# Altium schematic sheet Estacion_Meteorologica_Feather _M0.SchDoc
size A4; SheetNumber: 1; SheetTotal: 4; SPICEModelCacheEYFLLTXP: <root> / <DocumentId>EYFLLTXP</DocumentId> / </root>
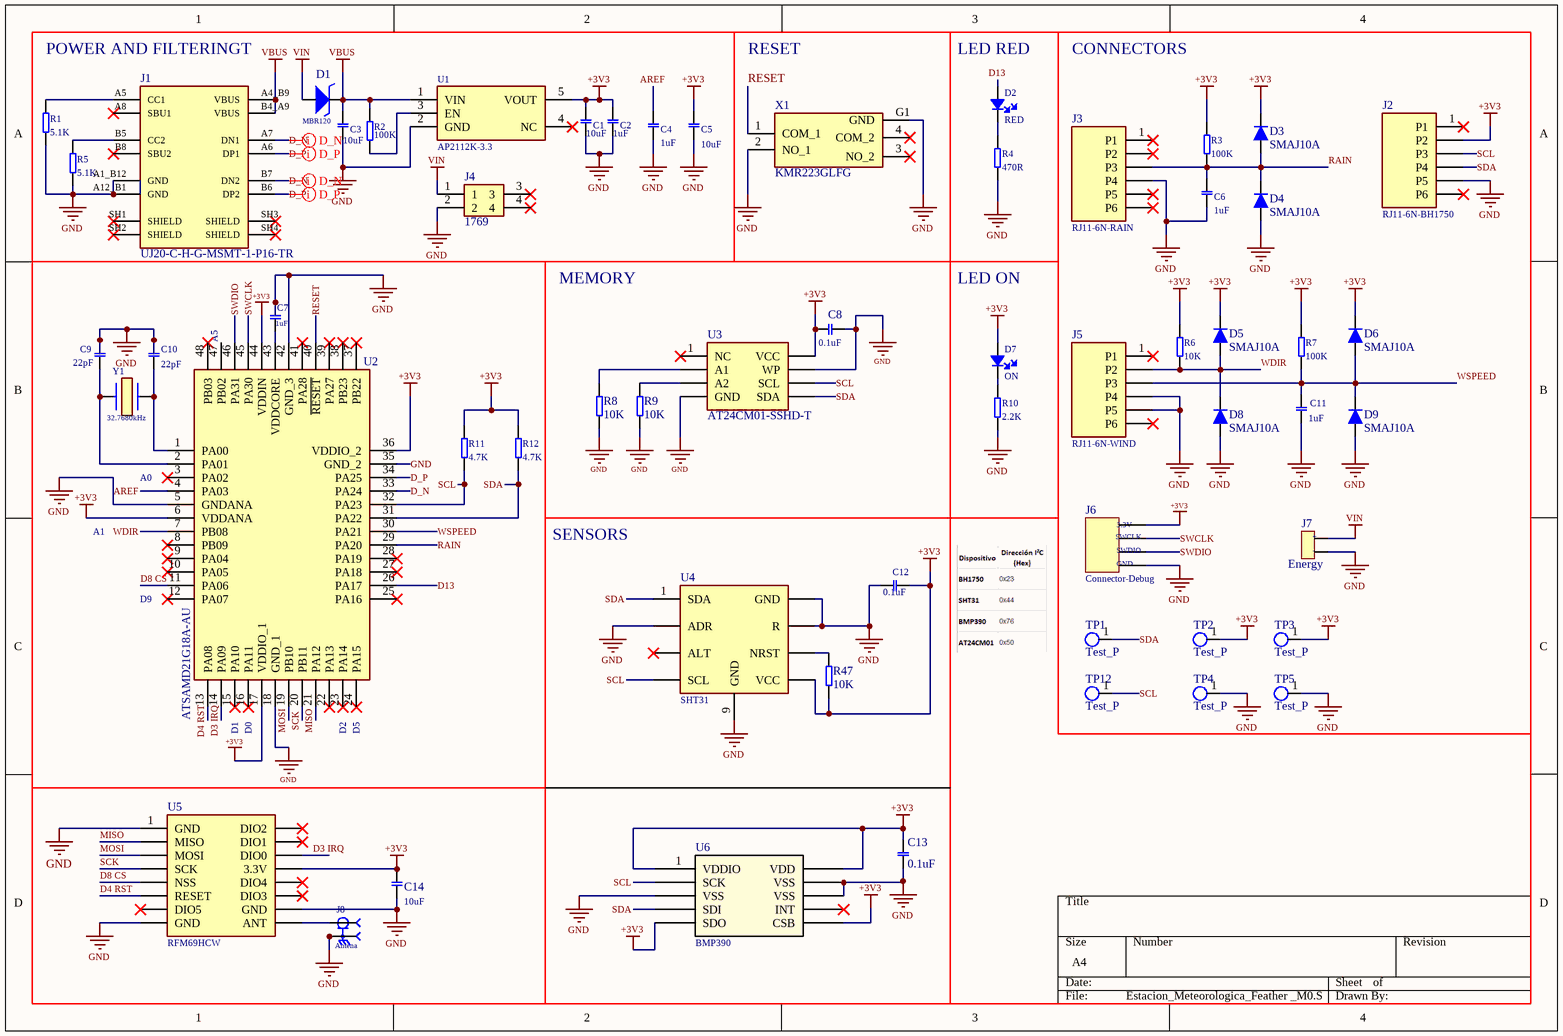
[diagram p0: Estacion_Meteorologica_Feather _M0.SchDoc]

## Parts
C1  10uF  [CAPCP1608_0603]
C2  1uF  [CAPCP1608_0603]
C3  10uF  [CAPCP1608_0603]
C4  1uF  [CAPCP1608_0603]
C5  10uF  [CAPCP1608_0603]
C6  1uF  [CAPCP1608_0603]
C7  1uF  [CAPCP1608_0603]
C8  0.1uF  [CAPCP1608_0603]
C9  22pF  [CAPCP1608_0603]
C10  22pF  [CAPCP1608_0603]
C11  1uF  [CAPCP1608_0603]
C12  0.1uF  [CAPCP1608_0603]
C13  0.1uF  [CAPCP1608_0603]
C14  10uF  [CAPCP1608_0603]
D1  MBR120  [SODFL3616X98N]
D2  RED  [DIODO_0603]
D3  SMAJ10A  [DIOM4325X250N]
D4  SMAJ10A  [DIOM4325X250N]
D5  SMAJ10A  [DIOM4325X250N]
D6  SMAJ10A  [DIOM4325X250N]
D7  ON  [DIODO_0603]
D8  SMAJ10A  [DIOM4325X250N]
D9  SMAJ10A  [DIOM4325X250N]
J1  UJ20-C-H-G-MSMT-1-P16-TR  [uJ20-C-H-G-MSMT-1-P16-TR]
J2  RJ11-6N-BH1750  [TE_RJ11-6N-B]
J3  RJ11-6N-RAIN  [TE_RJ11-6N-B]
J4  1769  [1769_Conector_Bateria]
J5  RJ11-6N-WIND  [TE_RJ11-6N-B]
J6  Connector-Debug  [HDR1X4]
J7  Energy  [HDR1X2_2]
J8  Antena  [SAMTEC_RSP-122811-01]
R1  5.1K  [RESC1608_0603]
R2  100K  [RESC1608_0603]
R3  100K  [RESC1608_0603]
R4  470R  [RESC1608_0603]
R5  5.1K  [RESC1608_0603]
R6  10K  [RESC1608_0603]
R7  100K  [RESC1608_0603]
R8  10K  [RESC1608_0603]
R9  10K  [RESC1608_0603]
R10  2.2K  [RESC1608_0603]
R11  4.7K  [RESC1608_0603]
R12  4.7K  [RESC1608_0603]
R47  10K  [RESC1608_0603]
TP1  Test_P  [Test_point]
TP2  Test_P  [Test_point]
TP3  Test_P  [Test_point]
TP4  Test_P  [Test_point]
TP5  Test_P  [Test_point]
TP12  Test_P  [Test_point]
U1  AP2112K-3.3  [SOT-23-5]
U2  ATSAMD21G18A-AU  [QFP-48N]
U3  AT24CM01-SSHD-T  [SOIC-8N]
U4  SHT31  [SON50P250X250X90-9T110X180N]
U5  RFM69HCW  [COM-13909]
U6  BMP390  [10LGA_2X2X0p75_BOS-M]
X1  KMR223GLFG  [KMR223GLFG_Boton]
Y1  32.7680kHz  [XTAL 830050789]

## Nets
+3V3: C1.2 C2.2 C5.2 C8.1 C12.2 C13.2 C14.2 D3.2 D5.2 D6.2 D7.1 J2.2(P2) J6.1 R3.2 R6.2 R7.2 R11.2 R12.2 R47.1 TP2.1 TP3.1 U1.5(VOUT) U2.6(VDDANA) U2.17(VDDIO_1) U2.36(VDDIO_2) U2.44(VDDIN) U3.8(VCC) U4.5(VCC) U5.13(3.3V) U6.1(VDDIO) U6.5(SDO) U6.6(CSB) U6.10(VDD)
GND: C1.1 C2.1 C3.1 C4.1 C5.1 C6.1 C7.2 C8.2 C9.2 C10.2 C11.1 C12.1 C13.1 C14.1 D4.1 D8.1 D9.1 J1.A1_B12(GND) J1.A12_B1(GND) J2.5(P5) J3.4(P4) J4.2 J5.4(P4) J5.5(P5) J6.4 J7.2 J8.G1(GND) J8.G2(GND) R1.1 R4.1 R5.1 R8.1 R9.1 R10.2 TP4.1 TP5.1 U1.2(GND) U2.5(GNDANA) U2.18(GND_1) U2.35(GND_2) U2.42(GND_3) U3.4(GND) U3.7(WP) U4.2(ADR) U4.7(R) U4.8(GND) U4.9(GND) U5.1(GND) U5.8(GND) U5.10(GND) U6.3(VSS) U6.8(VSS) U6.9(VSS) X1.2(NO_1) X1.G1(GND)
VBUS: C3.2 D1.2 J1.A4_B9(VBUS) J1.B4_A9(VBUS) R2.2 U1.1(VIN)
VIN: D1.1 J4.1 J7.1
AREF: C4.2 U2.4(PA03)
D3 IRQ: U2.14(PA09) U5.14(DIO0)
D4 RST: U2.13(PA08) U5.6(RESET)
D8 CS: U2.11(PA06) U5.5(NSS)
D13: D2.1 U2.26(PA17)
D_N: J1.A7(DN1) J1.B7(DN2) U2.33(PA24)
D_P: J1.A6(DP1) J1.B6(DP2) U2.34(PA25)
MISO: U2.21(PA12) U5.2(MISO)
MOSI: U2.19(PB10) U5.3(MOSI)
RAIN: C6.2 D3.1 D4.2 J3.3(P3) R3.1 U2.29(PA20)
RESET: U2.40(~{RESET}) X1.1(COM_1)
SCK: U2.20(PB11) U5.4(SCK)
SCL: J2.3(P3) R11.1 TP12.1 U2.32(PA23) U3.6(SCL) U4.4(SCL) U6.2(SCK)
SDA: J2.4(P4) R12.1 TP1.1 U2.31(PA22) U3.5(SDA) U4.1(SDA) U6.4(SDI)
SWCLK: J6.2 U2.45(PA30)
SWDIO: J6.3 U2.46(PA31)
WDIR: D5.1 D8.2 J5.2(P2) R6.1 U2.7(PB08)
WSPEED: C11.2 D6.1 D9.2 J5.3(P3) R7.1 U2.30(PA21)
NetC7_1: C7.1 U2.43(VDDCORE)
NetC9_1: C9.1 U2.2(PA01) Y1.1
NetC10_1: C10.1 U2.1(PA00) Y1.2
NetD2_2: D2.2 R4.2
NetD7_2: D7.2 R10.1
NetJ1_A5: J1.A5(CC1) R1.2
NetJ1_B5: J1.B5(CC2) R5.2
NetJ8_1: J8.1 U5.9(ANT)
NetR2_1: R2.1 U1.3(EN)
NetR8_2: R8.2 U3.2(A1)
NetR9_2: R9.2 U3.3(A2)
NetR47_2: R47.2 U4.6(NRST)

Not connected (* = marked no-connect by the designer): J1 A8(SBU1)* B8(SBU2)* SH1(SHIELD)* SH2(SHIELD)* SH3(SHIELD)* SH4(SHIELD)*; J2 1(P1)* 6(P6)*; J3 1(P1)* 2(P2)* 5(P5)* 6(P6)*; J4 3* 4*; J5 1(P1)* 6(P6)*; U1 4(NC)*; U2 3(PA02)* 8(PB09)* 9(PA04)* 10(PA05)* 12(PA07)* 15(PA10)* 16(PA11)* 22(PA13)* 23(PA14)* 24(PA15)* 25(PA16)* 27(PA18)* 28(PA19)* 37(PB22)* 38(PB23)* 39(PA27)* 41(PA28)* 47(PB02) 48(PB03)*; U3 1(NC)*; U4 3(ALT)*; U5 7(DIO5)* 11(DIO3)* 12(DIO4)* 15(DIO1)* 16(DIO2)*; U6 7(INT)*; X1 3(NO_2)* 4(COM_2)*

## Layout directives
differential pair: D_N, D_P

## Notes on the sheet
- POWER AND FILTERINGT
- RESET
- (near D2) LED RED
- CONNECTORS
- MEMORY
- LED ON
- (near U2) A5
- (near U2) A0
- A1
- SENSORS
- (near U2) D9
- (near U2) D1
- (near U2) D0
- (near U2) D2
- (near U2) D5
- (in symbol Connector_04_debug) 3.3V; SWCLK; SWDIO; GND
- (in symbol Connector_energy) +; -

## Library data of the parts
C1 C3 C5 C14 = C0603X100J1GACAUTO: Capacitor_10uF_0603
C2 C4 C6 C7 C11 = C0603X105J4RACTU: Capacitor_1uF_0603
C8 C12 C13 = 06035C104K4T4A: Capacitor_0.1uF_0603
C9 C10 = C0603C220J1GAC: Capacitor_22pF_0603
D1 = MBR120ESFT3G: Diodo_Zenner_Sod-123FL-2
D2 D7 = SML-D12D1WT86: LED_NARANJA_0603
D3-D6 D8 D9 = SMAJ10A: TVS Diode 10V 400W Unidirectional SMAJ10A (DO-214AC)
J1 = UJ20-C-H-G-MSMT-1-P16-TR: Conector usb c; Package: None; Price: None; Value: *; MP: UJ20-C-H-G-MSMT-1-P16-TR; Availability: Unavailable
J2 J3 J5 = RJ11-6N-B: 6 Position 1 Port Right Angle RJ11 Low Profile Filtered EMI/RFI Modular Jack; MF: TE Connectivity; MP: RJ11-6N-B; Price: None; Purchase-URL: https://pricing.snapeda.com/search/part/RJ11-6N-B/?ref=eda; Package: None; Check_prices: https://www.snapeda.com/parts/RJ11-6N-B/TE+Connectivity+Corcom+Filters/view-part/?ref=eda; Value: *; Availability: In Stock; SnapEDA_Link: https://www.snapeda.com/parts/RJ11-6N-B/TE+Connectivity+Corcom+Filters/view-part/?ref=snap
J4 = 1769: Adafruit Accessories JST-PH 2-pin SMT Right Angle Connect; Geometry.Height: 5.5mm; Mouser Part Number: 485-1769; Mouser Price/Stock: https://www.mouser.co.uk/ProductDetail/Adafruit/1769?qs=GURawfaeGuBbgoGtf2XstA%3D%3D; Manufacturer_Name: Adafruit; Manufacturer_Part_Number: 1769; Datasheet Link: https://cdn-shop.adafruit.com/datasheets/17311.pdf
J6 = Connector_04_debug
J7 = Connector_energy: Conector de gestor de carga
J8 = RSP-122811-01: U.FL (UMCC), IPEX MHF1 Connector Receptacle, Male Pin 50Ohm Surface Mount Solder; Availability: Unavailable; MP: RSP-122811-01; Value: *; Price: None; Package: None
R1 R5 = RCA06035K10JNEA: Resistencia_5.1K_0603
R2 R3 R7 = RCA0603100KFKEAHP: Resistencia_100K_0603
R4 = RCA0603470RFKEA: Resistencia_470R_0603
R6 R8 R9 R47 = RCA060310K0JNEA: Resistencia_10K_0603
R10 = RCA06032K21FKTA: Resistencia_2.2K_0603
R11 R12 = RCA06034K70FKEA: Resistencia_4.7K_0603
TP1-TP5 TP12 = Test_point
U1 = AP2112K-3.3TRG1: 600mA 3.3V LDO Regulator Enable SOT23-5 DiodesZetex AP2112K-3.3TRG1, LDO Voltage Regulator, 3.3 V +/-1.5%, 2.5  6 Vin, 5-Pin SOT-23; Manufacturer_Name: Diodes Incorporated; Geometry.Height: 1.4mm; Mouser Part Number: 621-AP2112K-3.3TRG1; Mouser Price/Stock: https://www.mouser.co.uk/ProductDetail/Diodes-Incorporated/AP2112K-3.3TRG1?qs=x6A8l6qLYDDPYHosCdzh%2FA%3D%3D; Manufacturer_Part_Number: AP2112K-3.3TRG1; Datasheet Link: https://www.diodes.com//assets/Datasheets/AP2112.pdf
U2 = ATSAMD21G18A-AU: ARM Microcontrollers - MCU 256KB 32KB 48TQFP GRN1.6-3.6V48MHz; Manufacturer_Name: Microchip; Geometry.Height: 1.2mm; Mouser Part Number: 556-ATSAMD21G18A-AU; Mouser Price/Stock: https://www.mouser.co.uk/ProductDetail/Microchip-Technology/ATSAMD21G18A-AU?qs=KLFHFgXTQiDh1vL0VLU76Q%3D%3D; Manufacturer_Part_Number: ATSAMD21G18A-AU; Datasheet Link: https://datasheet.lcsc.com/lcsc/1810010234_Microchip-Tech-ATSAMD21G18A-AU_C78624.pdf
U3 = AT24CM01-SSHD-T: EEPROM SERIAL EEPROM, 1M 2-WIR-8 SOIC; Manufacturer_Name: Microchip; Geometry.Height: 1.75mm; Mouser Part Number: 556-AT24CM01-SSHD-T; Mouser Price/Stock: https://www.mouser.co.uk/ProductDetail/Microchip-Technology/AT24CM01-SSHD-T?qs=s44pgLhgXQig9Z6HBeFbBg%3D%3D; Manufacturer_Part_Number: AT24CM01-SSHD-T; Datasheet Link: https://4donline.ihs.com/images/VipMasterIC/IC/ATML/ATML-S-A0000726505/ATML-S-A0000726505-1.pdf?hkey=EF798316E3902B6ED9A73243A3159BB0
U4 = SHT31: Humidity Temperature Sensor 0 ~ 100% RH Analog Voltage Â±2% RH 8s Surface Mount; MF: Sensirion AG; Package: VFDFN-8 Sensirion AG; Price: None; MP: SHT31; Purchase-URL: https://pricing.snapeda.com/search/part/SHT31/?ref=eda; Availability: In Stock; Value: *; Check_prices: https://www.snapeda.com/parts/SHT31/Sensirion+AG/view-part/?ref=eda; SnapEDA_Link: https://www.snapeda.com/parts/SHT31/Sensirion+AG/view-part/?ref=snap
U5 = COM-13909: Rfm69hcw Wireless Transceiver 91; Value: *; MP: COM-13909; Package: None; Availability: Unavailable; Price: None
U6 = BMP390: Barometric Pressure Sensor, I2C/SPI, 300-1250 hPa; Mfr_Name: Bosch Sensortec; RefDes: RefDes; Type: Type
X1 = KMR223GLFG_1: Tactile Switch SPST-NO Top Actuated Surface Mount; Manufacturer_Name: C & K COMPONENTS; Geometry.Height: 1.9mm; Mouser Part Number: 611-KMR223GLFG; Mouser Price/Stock: https://www.mouser.co.uk/ProductDetail/CK/KMR223GLFG?qs=sb%252But3Lm4x2f%252B935G%252B3m6Q%3D%3D; Manufacturer_Part_Number: KMR223GLFG; Datasheet Link: https://www.ckswitches.com/media/1479/kmr2.pdf
Y1 = 830050789: XTAL 32.7680kHz 20ppm 2.0 x 1.2mm